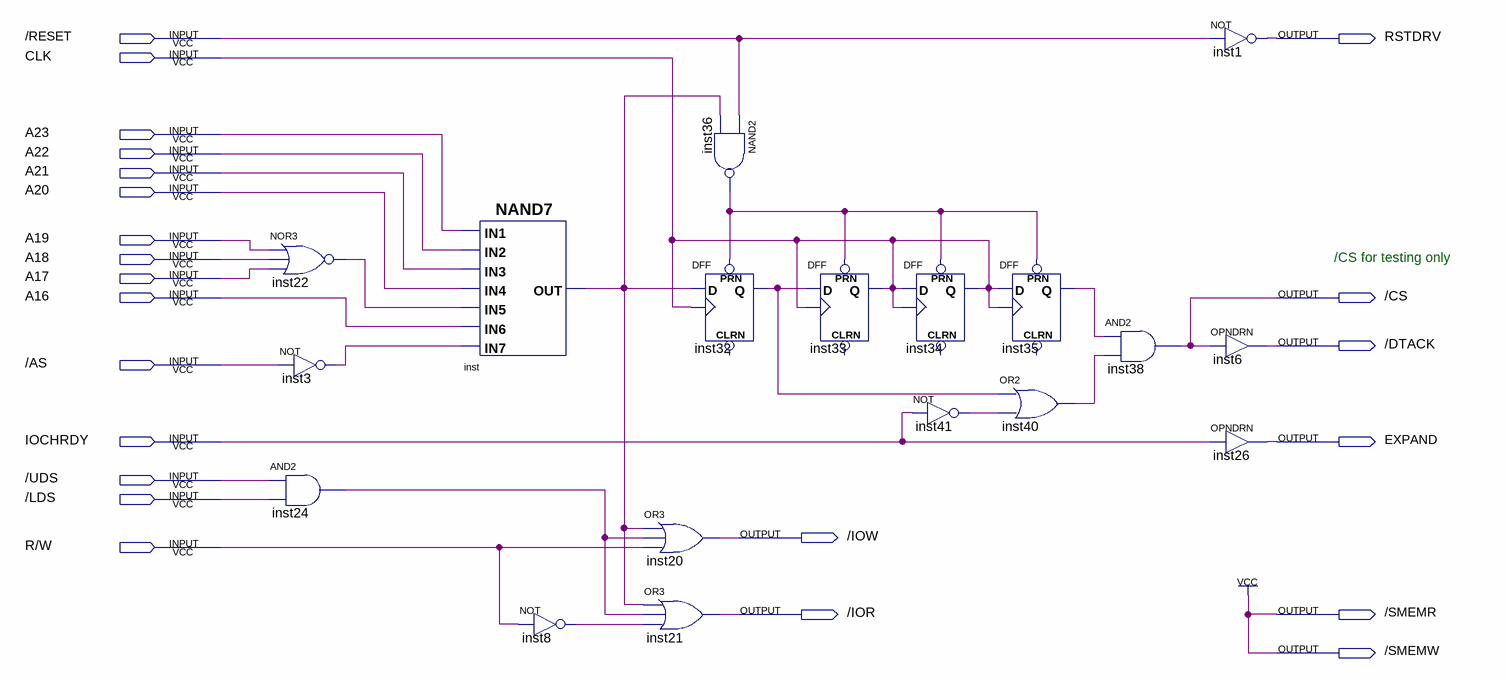
[diagram p0: schematic sheet]
// Quartus schematic falcon.bdf as structural Verilog: 18 symbols, 23 pins
module falcon (
  input  \/RESET ,
  input  CLK,
  input  A23,
  input  A22,
  input  A21,
  input  A20,
  input  A19,
  input  A18,
  input  A17,
  input  A16,
  input  \/AS ,
  input  IOCHRDY,
  input  \/UDS ,
  input  \/LDS ,
  input  \R/W ,
  output RSTDRV,
  output \/CS ,
  output \/DTACK ,
  output EXPAND,
  output \/IOW ,
  output \/IOR ,
  output \/SMEMR ,
  output \/SMEMW 
);

  wire inst3_out, inst8_out, inst22_out, inst24_out, inst32_q, inst35_q, inst36_out, inst40_out, inst41_out,
       inst_out;

  nor inst22 (inst22_out, A19, A18, A17);
  not inst3 (inst3_out, \/AS );
  and inst24 (inst24_out, \/UDS , \/LDS );
  nand inst (inst_out, A23, A22, A21, A20, inst22_out, A16, inst3_out);
  not inst8 (inst8_out, \R/W );
  or inst20 (\/IOW , inst_out, inst24_out, \R/W );
  or inst21 (\/IOR , inst_out, inst24_out, inst8_out);
  nand inst36 (inst36_out, \/RESET , inst_out);
  DFF inst32 (.CLK(CLK), .D(inst_out), .PRN(inst36_out), .Q(inst32_q));  // open: CLRN
  DFF inst33 (.CLK(CLK), .D(inst32_q), .PRN(inst36_out), .Q(CLK));  // open: CLRN
  DFF inst34 (.CLK(CLK), .D(CLK), .PRN(inst36_out), .Q(CLK));  // open: CLRN
  not inst41 (inst41_out, IOCHRDY);
  DFF inst35 (.CLK(CLK), .D(CLK), .PRN(inst36_out), .Q(inst35_q));  // open: CLRN
  or inst40 (inst40_out, inst32_q, inst41_out);
  and inst38 (\/CS , inst35_q, inst40_out);
  not inst1 (RSTDRV, \/RESET );
  OPNDRN inst6 (.IN(\/CS ), .OUT(\/DTACK ));
  OPNDRN inst26 (.IN(IOCHRDY), .OUT(EXPAND));

  assign \/SMEMR  = 1'b1;
  assign \/SMEMW  = 1'b1;

  // Notes on the sheet:
  //   /CS for testing only
endmodule
